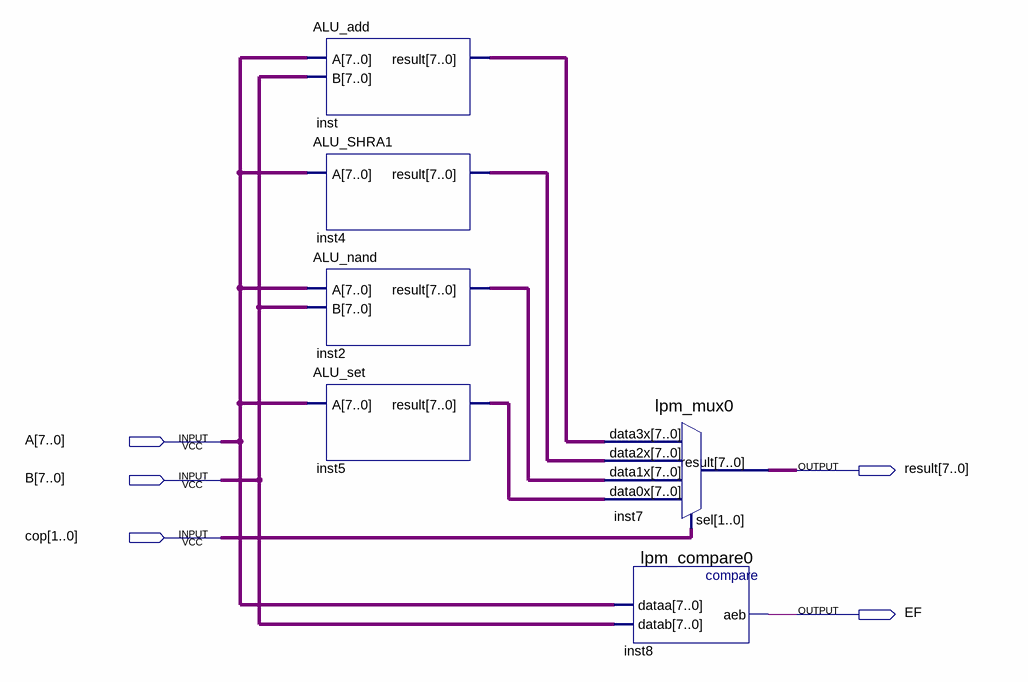
[diagram p0: schematic sheet]
// Quartus schematic ALU.bdf as structural Verilog: 6 symbols, 5 pins
module ALU (
  input  [7:0] A,
  input  [7:0] B,
  input  [1:0] cop,
  output [7:0] result,
  output EF
);

  wire [7:0] inst2_result, inst4_result, inst5_result, inst_result;

  ALU_add inst (.A(A), .B(B), .result(inst_result));
  ALU_SHRA1 inst4 (.A(A), .result(inst4_result));
  ALU_nand inst2 (.A(A), .B(B), .result(inst2_result));
  ALU_set inst5 (.A(A), .result(inst5_result));
  lpm_mux0 inst7 (
    .data3x(inst_result), .data2x(inst4_result), .data1x(inst2_result), .data0x(inst5_result), .sel(cop),
    .result(result));
  lpm_compare0 inst8 (.dataa(A), .datab(B), .aeb(EF));
endmodule
